# Altium schematic sheet portExpander.SchDoc
size A4; DocumentNumber: 6; SheetNumber: 6; SheetTotal: 11
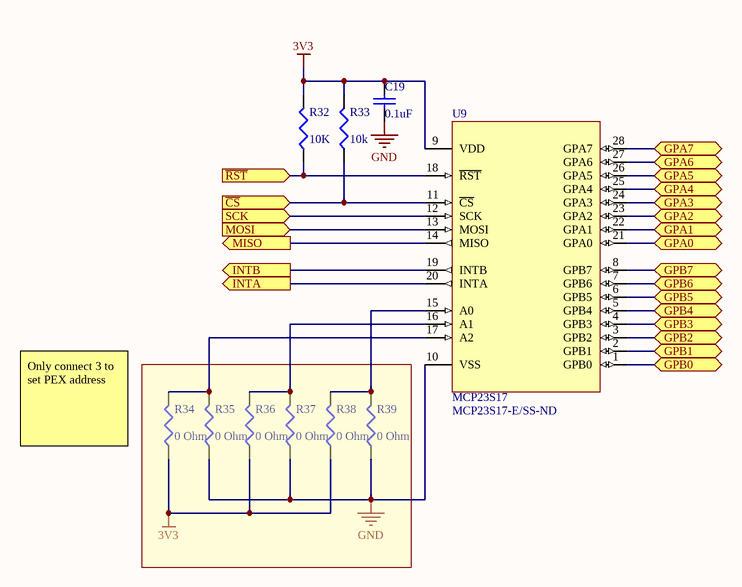
[diagram p0: portExpander.SchDoc]

## Parts
C19  0.1uF  [1608[0603]]
R32  10K  [J1-0603]
R33  10k  [J1-0603]
R34  0 Ohm  [J1-0603]
R35  0 Ohm  [J1-0603]
R36  0 Ohm  [J1-0603]
R37  0 Ohm  [J1-0603]
R38  0 Ohm  [J1-0603]
R39  0 Ohm  [J1-0603]
U9  MCP23S17  Supplier Part Number 1: MCP23S17-E/SS-ND  [SOP65P780X200-28N]

## Ports
GPA0 (bidir), GPA1 (bidir), GPA2 (bidir), GPA3 (bidir), GPA4 (bidir), GPA5 (bidir), GPA6 (bidir), GPA7 (bidir), GPB0 (bidir), GPB1 (bidir), GPB2 (bidir), GPB3 (bidir), GPB4 (bidir), GPB5 (bidir), GPB6 (bidir), GPB7 (bidir), INTA (out), INTB (out), MISO (out), MOSI (in), SCK (in), ~{CS} (in), ~{RST} (in)

## Nets
3V3: C19.2 R32.2 R33.2 R34.1 R36.1 R38.1 U9.9(VDD)
GND: C19.1 R35.1 R37.1 R39.1 U9.10(VSS)
~{CS}: R33.1 U9.11(~{CS}) ; port ~{CS}
GPA0: U9.21(GPA0) ; port GPA0
GPA1: U9.22(GPA1) ; port GPA1
GPA2: U9.23(GPA2) ; port GPA2
GPA3: U9.24(GPA3) ; port GPA3
GPA4: U9.25(GPA4) ; port GPA4
GPA5: U9.26(GPA5) ; port GPA5
GPA6: U9.27(GPA6) ; port GPA6
GPA7: U9.28(GPA7) ; port GPA7
GPB0: U9.1(GPB0) ; port GPB0
GPB1: U9.2(GPB1) ; port GPB1
GPB2: U9.3(GPB2) ; port GPB2
GPB3: U9.4(GPB3) ; port GPB3
GPB4: U9.5(GPB4) ; port GPB4
GPB5: U9.6(GPB5) ; port GPB5
GPB6: U9.7(GPB6) ; port GPB6
GPB7: U9.8(GPB7) ; port GPB7
INTA: U9.20(INTA) ; port INTA
INTB: U9.19(INTB) ; port INTB
MISO: U9.14(MISO) ; port MISO
MOSI: U9.13(MOSI) ; port MOSI
~{RST}: R32.1 U9.18(~{RST}) ; port ~{RST}
SCK: U9.12(SCK) ; port SCK
NetR34_2: R34.2 R35.2 U9.17(A2)
NetR36_2: R36.2 R37.2 U9.16(A1)
NetR38_2: R38.2 R39.2 U9.15(A0)

## Notes on the sheet
- (near R34) Only connect 3 to set PEX address

## Library data of the parts
C19 = Cap Semi: Capacitor (Semiconductor SIM Model); Published: 8-Jun-2000; LatestRevisionDate: 29-May-2009; LatestRevisionNote: IPC-7351 Footprint Added.; PackageReference: C1206; Publisher: Altium Limited; PackageDescription: Chip Capacitor; Value: 0.1uF; Supplier: Digi-Key; Supplier Part Number: 311-1341-1-ND; Supplier 1: Digi-Key
R32-R39 = Res3: Resistor; Published: 8-Jun-2000; LatestRevisionDate: 29-May-2009; LatestRevisionNote: IPC-7351 Footprint Added.; PackageReference: J1-0603; Publisher: Altium Limited; PackageDescription: Chip Resistor; Supplier: Digi-Key; Supplier 1: Digi-Key
  R32: Value: 10K; Supplier Part Number: RMCF0603JG10K0CT-ND
  R33: Value: 10k; Supplier Part Number: RMCF0603JG10K0CT-ND
  R34-R39: Value: 0 Ohm; Supplier Part Number: 541-2779-1-ND
U9 = MCP23S17: 16 bit I/O expander with SPI interface.; Supplier 1: Digi-Key; Supplier: Digi-Key; Supplier Part Number: MCP23S17-E/SS-ND